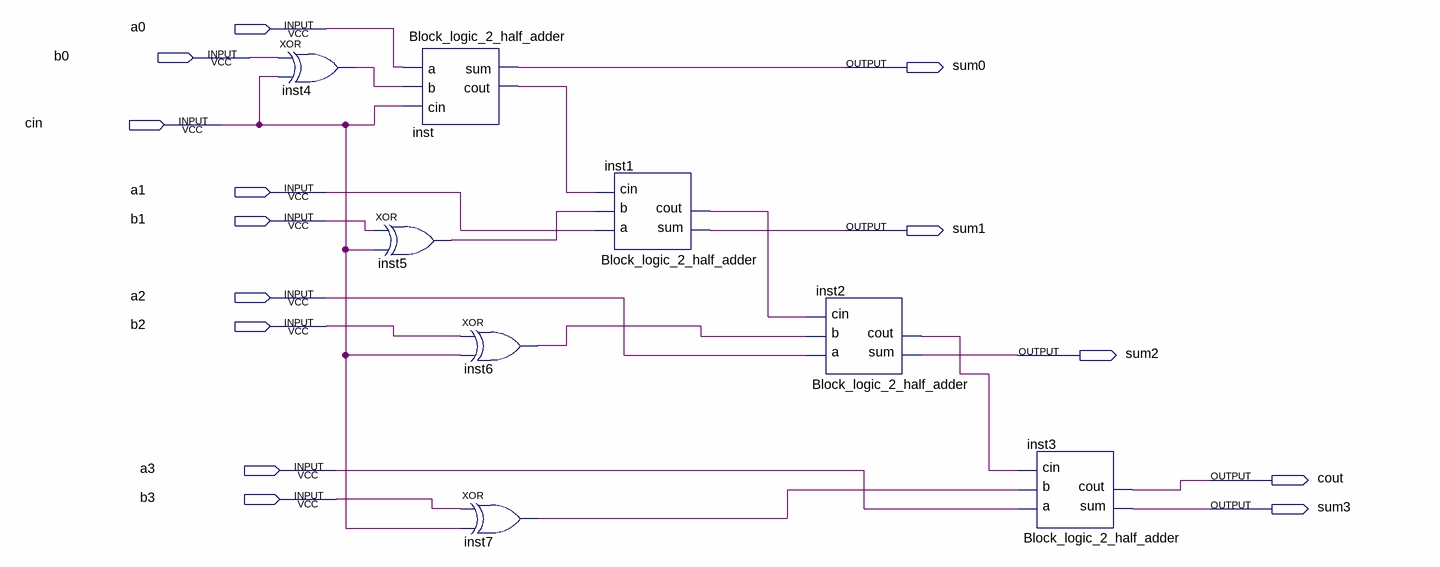
[diagram p0: schematic sheet]
// Quartus schematic Block_4_bit_add_sub.bdf as structural Verilog: 8 symbols, 14 pins
module Block_4_bit_add_sub (
  input  a0,
  input  b0,
  input  cin,
  input  a1,
  input  b1,
  input  a2,
  input  b2,
  input  a3,
  input  b3,
  output sum0,
  output sum1,
  output sum2,
  output cout,
  output sum3
);

  wire inst1_cout, inst2_cout, inst4_out, inst5_out, inst6_out, inst7_out, inst_cout;

  xor inst4 (inst4_out, b0, cin);
  Block_logic_2_half_adder inst (.a(a0), .b(inst4_out), .cin(cin), .sum(sum0), .cout(inst_cout));
  xor inst5 (inst5_out, b1, cin);
  xor inst6 (inst6_out, b2, cin);
  xor inst7 (inst7_out, b3, cin);
  Block_logic_2_half_adder inst1 (.a(a1), .b(inst5_out), .cin(inst_cout), .sum(sum1), .cout(inst1_cout));
  Block_logic_2_half_adder inst2 (.a(a2), .b(inst6_out), .cin(inst1_cout), .sum(sum2), .cout(inst2_cout));
  Block_logic_2_half_adder inst3 (.a(a3), .b(inst7_out), .cin(inst2_cout), .sum(sum3), .cout(cout));
endmodule
